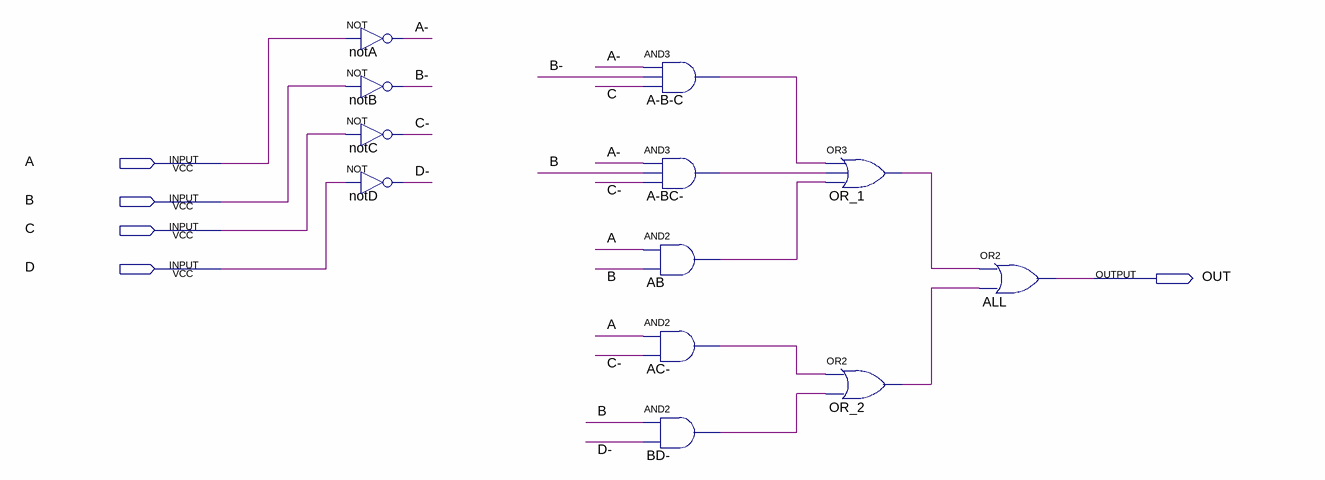
[diagram p0: schematic sheet]
// Quartus schematic g.bdf as structural Verilog: 12 symbols, 5 pins
module g (
  input  A,
  input  B,
  input  C,
  input  D,
  output OUT
);

  wire \A- , A_B_C_out, A_BC__out, AB_out, AC__out, \B- , BD__out, \C- , \D- , OR_1_out, OR_2_out;

  not notA (\A- , A);
  not notB (\B- , B);
  not notC (\C- , C);
  not notD (\D- , D);
  and \A-B-C  (A_B_C_out, \A- , \B- , C);
  and \A-BC-  (A_BC__out, \A- , B, \C- );
  and AB (AB_out, A, B);
  and \AC-  (AC__out, A, \C- );
  and \BD-  (BD__out, B, \D- );
  or OR_1 (OR_1_out, A_B_C_out, A_BC__out, AB_out);
  or OR_2 (OR_2_out, AC__out, BD__out);
  or ALL (OUT, OR_1_out, OR_2_out);
endmodule
